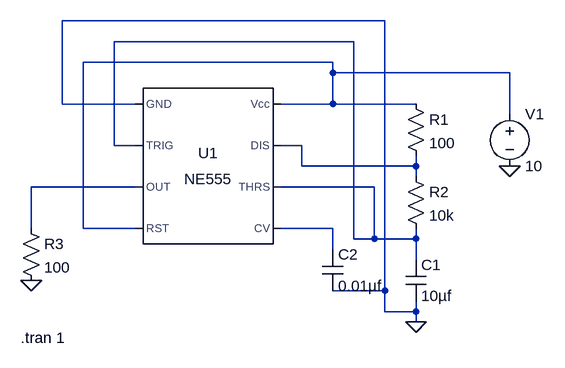
[diagram p0: schematic squarewave_generator.asc]
squarewave_generator.asc, the LTspice schematic file:
Version 4
SHEET 1 880 680
WIRE 512 -32 16 -32
WIRE 464 0 96 0
WIRE 432 32 48 32
WIRE 432 48 432 32
WIRE 704 48 432 48
WIRE 16 96 16 -32
WIRE 128 96 16 96
WIRE 432 96 432 48
WIRE 432 96 352 96
WIRE 560 96 432 96
WIRE 704 112 704 48
WIRE 96 160 96 0
WIRE 128 160 96 160
WIRE 384 160 352 160
WIRE 384 192 384 160
WIRE 560 192 560 176
WIRE 560 192 384 192
WIRE 560 208 560 192
WIRE 128 224 -32 224
WIRE 496 224 352 224
WIRE -32 288 -32 224
WIRE 48 288 48 32
WIRE 128 288 48 288
WIRE 432 288 352 288
WIRE 464 304 464 0
WIRE 496 304 496 224
WIRE 496 304 464 304
WIRE 560 304 560 288
WIRE 560 304 496 304
WIRE 432 320 432 288
WIRE 560 336 560 304
WIRE 512 384 512 -32
WIRE 512 384 432 384
WIRE 512 416 512 384
WIRE 560 416 560 400
WIRE 560 416 512 416
WIRE 560 432 560 416
FLAG 560 432 0
FLAG 704 192 0
FLAG -32 368 0
SYMBOL Misc\\NE555 240 192 R0
SYMATTR InstName U1
SYMBOL res 544 80 R0
SYMATTR InstName R1
SYMATTR Value 100
SYMBOL res 544 192 R0
SYMATTR InstName R2
SYMATTR Value 10k
SYMBOL cap 544 336 R0
SYMATTR InstName C1
SYMATTR Value 10µf
SYMBOL cap 416 320 R0
SYMATTR InstName C2
SYMATTR Value 0.01µf
SYMBOL voltage 704 96 R0
WINDOW 123 0 0 Left 0
WINDOW 39 0 0 Left 0
SYMATTR InstName V1
SYMATTR Value 10
SYMBOL res -48 272 R0
SYMATTR InstName R3
SYMATTR Value 100
TEXT -48 456 Left 2 !.tran 1

The netlist it stands for:
* squarewave_generator.asc
XU1 0 N001 N004 N002 N005 N001 N003 N002 NE555  ; pins GND TRIG OUT RST CV THRS DIS Vcc
R1 N002 N003 100
R2 N003 N001 10k
C1 N001 0 10µf
C2 N005 0 0.01µf
V1 N002 0 10
R3 N004 0 100
.tran 1
.lib NE555.sub
.backanno
.end